# Altium schematic sheet Ethernet.SchDoc
size B
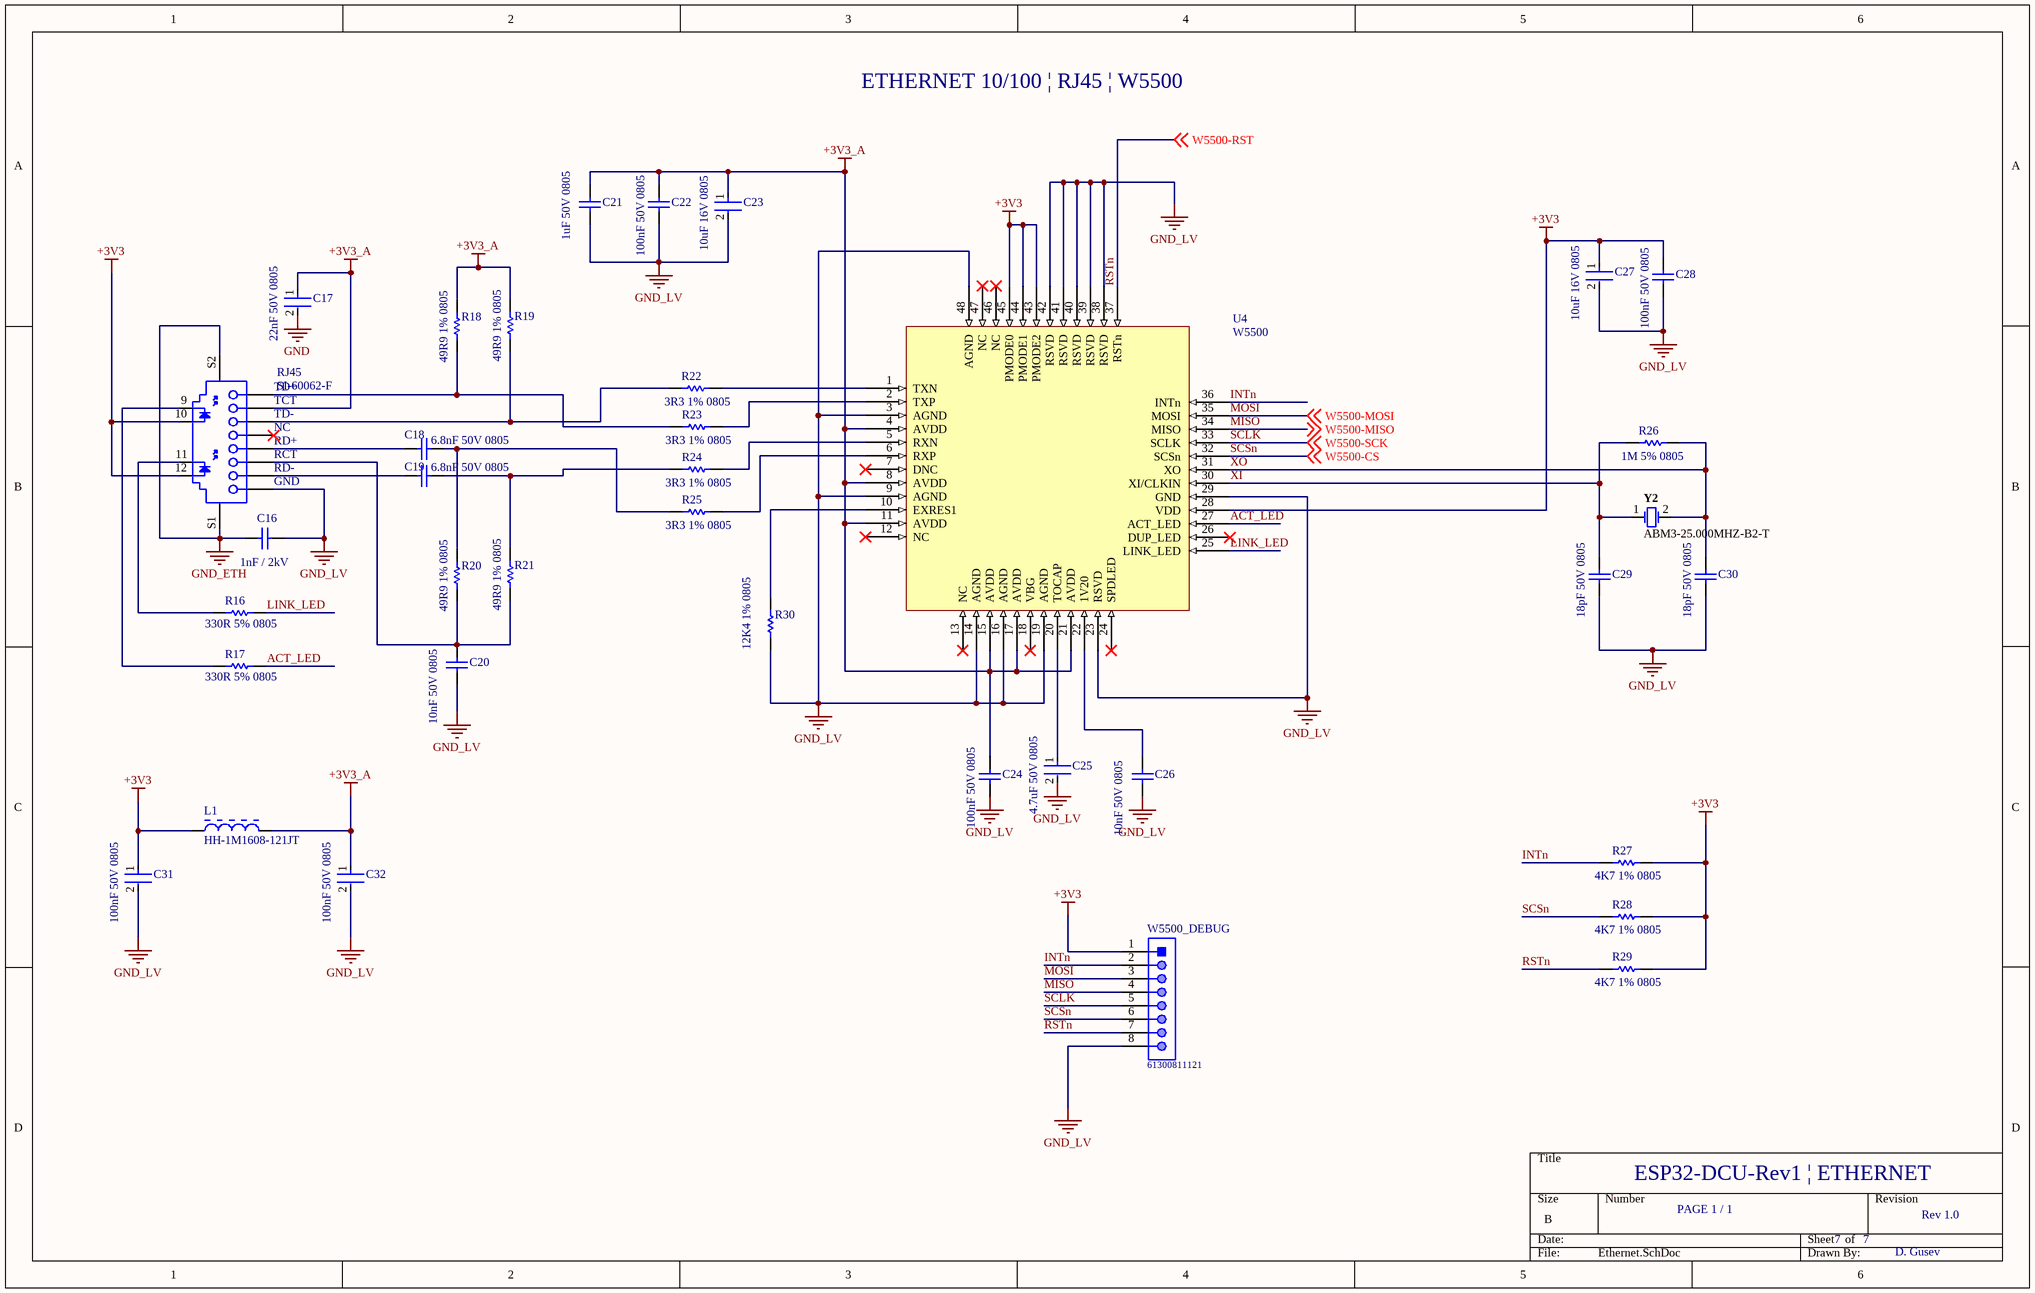
[diagram p0: Ethernet.SchDoc]

## Parts
C16  1nF / 2kV  [CAPC4532X155X60LL30T35]
C17  22nF 50V 0805  [FP-CL21-IPC_A]
C18  6.8nF 50V 0805  [CAPC2013X94X50NL20T25]
C19  6.8nF 50V 0805  [CAPC2013X94X50NL20T25]
C20  10nF 50V 0805  [CAPC2013X140X50NL20T25]
C21  1uF 50V 0805  [CAPC2013X135X45LL10T25]
C22  100nF 50V 0805  [CAPC2013X94X50ML20T25]
C23  10uF 16V 0805  [FP-GRM21B-0_1-IPC_C]
C24  100nF 50V 0805  [CAPC2013X94X50ML20T25]
C25  4.7uF 50V 0805  [FP-C2012-125-MFG]
C26  10nF 50V 0805  [CAPC2013X140X50NL20T25]
C27  10uF 16V 0805  [FP-GRM21B-0_1-IPC_C]
C28  100nF 50V 0805  [CAPC2013X94X50ML20T25]
C29  18pF 50V 0805  [CAPC2013X71X50LL20T25]
C30  18pF 50V 0805  [CAPC2013X71X50LL20T25]
C31  100nF 50V 0805  [FP-C0805C-DN-MFG]
C32  100nF 50V 0805  [FP-C0805C-DN-MFG]
L1  HH-1M1608-121JT  [CTC-1608_L]
R16  330R 5% 0805  [RESC2013X60X35LL10T20]
R17  330R 5% 0805  [RESC2013X60X35LL10T20]
R18  49R9 1% 0805  [RESC2013X60X40LL20T25]
R19  49R9 1% 0805  [RESC2013X60X40LL20T25]
R20  49R9 1% 0805  [RESC2013X60X40LL20T25]
R21  49R9 1% 0805  [RESC2013X60X40LL20T25]
R22  3R3 1% 0805  [RESC2013X70X40ML20T20]
R23  3R3 1% 0805  [RESC2013X70X40ML20T20]
R24  3R3 1% 0805  [RESC2013X70X40ML20T20]
R25  3R3 1% 0805  [RESC2013X70X40ML20T20]
R26  1M 5% 0805  [RESC2013X70X40NL20T20]
R27  4K7 1% 0805  [YAGO-RC0805_M]
R28  4K7 1% 0805  [YAGO-RC0805_M]
R29  4K7 1% 0805  [YAGO-RC0805_M]
R30  12K4 1% 0805  [RESC2013X60X35NL10T20]
RJ45  SI-60062-F  [BELF-SI-60062-F_V]
U4  W5500  [W5500]
W5500_DEBUG  61300811121  [61300811121]
Y2  ABM3-25.000MHZ-B2-T  [ABRA-ABM3_V]

## Nets
+3V3: C27.1 C28.2 C31.1 L1.1 R27.2 R28.2 R29.2 RJ45.10 RJ45.12 U4.28(VDD) U4.43(PMODE2) U4.44(PMODE1) U4.45(PMODE0) W5500_DEBUG.1
+3V3_A: C17.1 C21.2 C22.2 C23.1 C24.2 C32.1 L1.2 R18.2 R19.2 RJ45.2(TCT) U4.4(AVDD) U4.8(AVDD) U4.11(AVDD) U4.15(AVDD) U4.17(AVDD) U4.21(AVDD)
GND: C17.2
GND_ETH: C16.1 RJ45.S1 RJ45.S2
GND_LV: C16.2 C20.1 C21.1 C22.1 C23.2 C24.1 C25.2 C26.1 C27.2 C28.1 C29.1 C30.1 C31.2 C32.2 R30.1 RJ45.8(GND) U4.3(AGND) U4.9(AGND) U4.14(AGND) U4.16(AGND) U4.19(AGND) U4.23(RSVD) U4.29(GND) U4.38(RSVD) U4.39(RSVD) U4.40(RSVD) U4.41(RSVD) U4.42(RSVD) U4.48(AGND) W5500_DEBUG.8
ACT_LED: R17.2 U4.27(ACT_LED)
INTn: R27.1 U4.36(INTn) W5500_DEBUG.2
LINK_LED: R16.2 U4.25(LINK_LED)
MISO: U4.34(MISO) W5500_DEBUG.4 ; off-sheet W5500-MISO  [also labelled W5500-MISO]
MOSI: U4.35(MOSI) W5500_DEBUG.3 ; off-sheet W5500-MOSI  [also labelled W5500-MOSI]
RSTn: R29.1 U4.37(RSTn) W5500_DEBUG.7 ; off-sheet W5500-RST  [also labelled W5500-RST]
SCLK: U4.33(SCLK) W5500_DEBUG.5 ; off-sheet W5500-SCK  [also labelled W5500-SCK]
SCSn: R28.1 U4.32(SCSn) W5500_DEBUG.6 ; off-sheet W5500-CS  [also labelled W5500-CS]
XI: C29.2 R26.1 U4.30(XI/CLKIN) Y2.1
XO: C30.2 R26.2 U4.31(XO) Y2.2
NetC18_1: C18.1 RJ45.5(RD+)
NetC18_2: C18.2 R20.2 R25.1
NetC19_1: C19.1 RJ45.7(RD-)
NetC19_2: C19.2 R21.2 R24.1
NetC20_2: C20.2 R20.1 R21.1 RJ45.6(RCT)
NetC25_1: C25.1 U4.20(TOCAP)
NetC26_2: C26.2 U4.22(1V20)
NetR16_1: R16.1 RJ45.11
NetR17_1: R17.1 RJ45.9
NetR18_1: R18.1 R23.1 RJ45.1(TD+)
NetR19_1: R19.1 R22.1 RJ45.3(TD-)
NetR22_2: R22.2 U4.1(TXN)
NetR23_2: R23.2 U4.2(TXP)
NetR24_2: R24.2 U4.5(RXN)
NetR25_2: R25.2 U4.6(RXP)
NetR30_2: R30.2 U4.10(EXRES1)

Not connected (* = marked no-connect by the designer): RJ45 4(NC)*; U4 7(DNC)* 12(NC)* 13(NC)* 18(VBG)* 24(SPDLED)* 26(DUP_LED)* 46(NC)* 47(NC)*

## Notes on the sheet
- ETHERNET 10/100 | RJ45 | W5500
- ESP32-DCU-Rev1 | ETHERNET
- PAGE 1 / 1
- 7
- Rev 1.0
- D. Gusev

## Library data of the parts
C16 = CMP-2000-06032-1: Chip Capacitor, 1000 pF, +/- 10%, 2000 V, -55 to 125 degC, 1812 (4532 Metric), RoHS, Tape and Reel; Manufacturer: Kemet; Kits: 399-5086-ND-KITCERHI-VOLTAGECAPS; Catalog Drawings: ACTU_1812; Capacitance: 1000pF; Product Training Modules: CapacitorBasics-TypicalUsesforCapacitors; Online Catalog: X7RDielectricHighVoltage; Other Names: 399-3447-1; Temperature Coefficient: X7R; Voltage - Rated: 2000V(2kV); Family: CeramicCapacitors; Height - Seated (Max): -; Standard Package: 1; Size / Dimension: 0.177"Lx0.126"W(4.50mmx3.20mm); Datasheet URL: http://capacitoredge.kemet.com/capedge2/DataSheet/Datasheet-C1812C102KGRACTU.pdf?pn=C1812C102KGRACTU; Datasheet Version: 09/2016; Thickness (Max): 0.061"(1.55mm); Applications: SMPSFiltering; Package Description: 2-Pin Surface Mount Device, Body 4.5 x 3.2 mm; Package Reference: 1812; Mounting Technology: SurfaceMount; Packaging: CutTape(CT); Manufacturer URL: http://www.kemet.com/; Operating Temperature: -55°C~125°C; Mounting Type: SurfaceMount,MLCC; Features: HighVoltage; Package / Case: 1812(4532Metric); Lead Spacing: -; Tolerance: ±10%; Lead Style: -; Series: C; Category: Capacitors; Ratings: -
C17 = CMP-13271-002911-1: CL21 Series 0805 22nF 50V ±10% Tolerance X7R Multilayer Ceramic Chip Capacitor; Depth: 1.25mm; Thickness: 0.03inch; Height: 0.65mm; Material: Ceramic; Case/Package: 0805; Voltage Rating (DC): 50V; Contact Plating: Tin; Package Quantity: 1; Case Code (Metric): 2012; Max Operating Temperature: 125°C; Packaging: Tape and Reel; Voltage Rating: 50V; Radiation Hardening: No; Length: 2mm; Mount: Surface Mount; Min Operating Temperature: -55°C; Tolerance: 10%; Case Code (Imperial): 0805; Voltage: 50V; Capacitance: 22nF; Dielectric: X7R; Lead Free: Lead Free; Width: 0.049inch
C18 C19 = CMP-1036-03710-2: Manufacturer: AVX Interconnect / Elco; Part Number: 08055C682KAT2A
C20 C26 = CMP-2007-04596-1: Manufacturer: AVX Interconnect / Elco; Part Number: 08052C103KAT2A
C21 = CMP-1036-04761-2: Manufacturer: Murata; Part Number: GRM21BR71H105KA12L
C22 C24 C28 = CMP-2000-05016-1: Chip Capacitor, Ceramic, 0.1 uF, 10%, 50 V, 0805, RoHS, Tape and Reel; Manufacturer: AVX; Dielectric: X7R; Case Size/Dimension: 0805; Tolerance (%): ±10%; Rated Voltage: 50V; Capacitance: 100nF; Datasheet URL: http://www.farnell.com/datasheets/319609.pdf; Datasheet Version: Sep-07; Manufacturer URL: http://www.avx.com/
C23 C27 = CMP-2007-03453-2: Chip Multilayer Ceramic Capacitors for General Purpose, 0805, 10uF, X5R, 15%, 10%, 16V; Radiation Hardening: No; Thickness: 0.053inch; Voltage Rating (DC): 16V; Lead Free: Lead Free; Package Quantity: 1; Width: 1.25mm; Case Code (Imperial): 0805; Depth: 1.25mm; Packaging: Tape and Reel; Dielectric: X5R; Max Operating Temperature: 85°C; Tolerance: 10%; Voltage Rating: 16V; Voltage: 16V; Capacitance: 10uF; Height: 1.25mm; Case Code (Metric): 2012; Material: Ceramic; Mount: Surface Mount; Case/Package: 0805; REACH SVHC: No SVHC; Length: 2mm; Min Operating Temperature: -55°C; Termination: SMD/SMT
C25 = CMP-08246-000007-1: CAP CER 4.7UF 50V X5R 0805; Manufacturer Part Number: C2012X5R1H475K125AB; Manufacturer: TDK Corporation; Tolerance: 10%; Temperature Coefficient: 15%; Material: Ceramic; Mouser Description: Multilayer Ceramic Capacitors MLCC - SMD/SMT 0805 4.7uF 50volts X5R 10%; Category: Cap; Temperature Range High: +85°C; Digikey Description: CAP CER 4.7UF 50V X5R 0805; Voltage Rating: 50V; Device Class L1: Passive Components; Temperature Range Low: -55°C; Lead Free: Yes; ComponentLink2Description: Datasheet; Capacitance: 4.7uF; Octopart: https://octopart.com/c2012x5r1h475k125ab-tdk-25947720; Device Class L2: Capacitors; Value: 4.7uF; Temperature: -55°C to +85°C; ComponentLink2URL: https://product.tdk.com/info/en/catalog/datasheets/mlcc_commercial_general_en.pdf; RoHS: TRUE; Height: 1.45mm; Temperature Characteristic: X5R; Package: C2012-125; Device Class L3: Ceramic Capacitors; Automotive: No
C29 C30 = CMP-2007-04502-1: Manufacturer: AVX Interconnect / Elco; Part Number: 08055A180JAT2A
C31 C32 = CMP-2007-00279-2: CAP CER 0.1UF 50V X7R 0805; Manufacturer Part Number: C0805C104K5RACTU; Manufacturer: KEMET; Value: 0.10 μF; Tolerance: 0.1; Temperature Coefficient: 30ppm/°C; Material: Ceramic; Device Class L2: Capacitors; Temperature Range Low: -55°C; Voltage Rating: 50 V; Digikey Description: CAP CER 0.1UF 50V X7R 0805; Category: Cap; ComponentLink2Description: Datasheet; Octopart: https://octopart.com/c0805c104k5ractu-kemet-143926; RoHS: TRUE; ComponentLink2URL: https://content.kemet.com/datasheets/KEM_C1003_C0G_SMD.pdf; Temperature Characteristic: X7R; Temperature: -55°C to +125°C; Height: 0.88mm; Temperature Range High: +125°C; Device Class L1: Passive Components; Automotive: No; Lead Free: Yes; Ipc Land Pattern Name: CAPC200125X78; Device Class L3: Ceramic Capacitors; Mouser Description: Cap Ceramic 0.1uF 50V X7R 10% SMD 2.0 x 1.2 mm 125 C Paper T/R; Capacitance: 0.10 μF; Package: C0805C-DN
L1 = CMP-2000-06403-1: Chip Ferrite Bead, 0.14 Ohm, 1.1 A, -55 to 125 degC, 2-Pin SMD, RoHS, Tape and Reel; Manufacturer: CTC Coils; DC Resistance Max: 140MOhm; DC Current Max: 1.1A; Datasheet Version: 07/2004; Datasheet URL: http://data.icbank.com/ICBShop/board/beadhbm.pdf; PartNumber: HH-1M1608; Package Reference: 1608; Temperature Min: -55degC; Manufacturer URL: http://www.brokerforum.com/components-parts/CTCCoils-e-en.jsa; Mounting Technology: SurfaceMount; Temperature Max: 125degC; Package Description: 2-Pin Surface Mount Device, Body 1.6 x 0.8 mm; Packing: TapeandReel
R16 R17 = CMP-2000-06960-1: Chip Resistor, 330 Ohm, +/- 1%, 125 mW, -55 to 155 degC, 0805 (2012 Metric), RoHS, Tape and Reel; Manufacturer: Yageo; Voltage Rating: 150V; Temperature Coefficient: 100PPM/C; Power Rating: 125mW(1/8W); Resistance: 330Ohms; Datasheet Version: Rev. 7, 05/2017; Termination Style: SMD/SMT; Case Code - mm: 2012; Package Description: 2-Pin Surface Mounted Device, Body 2 x 1.25 mm; Operating Temperature Range: -55Cto+155C; Case Code - in: 0805; Packaging: Reel; Tolerance: 1%; Package Reference: 0805; Mounting Technology: SurfaceMount; Product: ThickFilmResistorsGeneralPurpose; Series: RC; Manufacturer URL: http://www.yageo.com/; Datasheet URL: http://www.yageo.com/documents/recent/PYu-RC_Group_51_RoHS_L_7.pdf
R18-R21 = CMP-2001-00841-1: Manufacturer: Panasonic; Part Number: ERA6AEB49R9V
R22-R25 = CMP-2001-00462-1: Part Number: ERJ-6RQF3R3V; Manufacturer: Panasonic
R26 = CMP-2001-04378-5: Chip Resistor, 1000 KOhm, +/- 1%, 0.125 W, -55 to 155 degC, 0805 (2012 Metric), RoHS, Tape and Reel; Manufacturer: Panasonic; Voltage Rating: 150 V; ComponentLink2URL: http://industrial.panasonic.com/cdbs/www-data/pdf/RDA0000/AOA0000C86.pdf; PackageReference: 0805; Min Operating Temperature: -55 degC; RoHSCompliant: true; Package Quantity: 5000; ComponentLink1URL: http://www.panasonic.com/; Pins: 2; Height: 0.6 mm; Packaging: Tape and Reel; ComponentLink2Description: Datasheet; ComponentLink1Description: Manufacturer URL; Mounting Technology: Surface Mount; REACH SVHC: Yes; Mount: Surface Mount; PackageDescription: 2-Pin Surface Mount Device, Body 2 x 1.25 mm; DatasheetVersion: 04/2015; Max Operating Temperature: 155 degC; Length: 2 mm
R27-R29 = CMP-1568-00001-1: General Puprose Chip Resistor, 4700 Ohm +/- 1%, 0.125 W, -55 to 155 degC, 2-Pin SMD, RoHS, Tape and Reel; PartNumber: RC0805FR-074K7L; Tolerance: +/- 1%; Power: 0.125 W; PackageDescription: 2-Pin Surface Mount Device, Body 2 x 1.25 mm; ComponentLink2URL: http://www.yageo.com/documents/recent/PYu-RC_Group_51_RoHS_L-3.pdf; Temperature Min: -55 degC; Packing: Tape and Reel; Mounting Technology: Surface Mount; ComponentLink1URL: http://www.yageo.com/NewPortal/_en/index.jsp; Resistance: 4700 Ohm; Temperature Max: 155 degC; ComponentLink2Description: Datasheet; DatasheetVersion: Rev. 3; RoHS: TRUE; ComponentLink1Description: Manufacturer URL
R30 = CMP-2001-00911-1: Part Number: RC0805FR-0712K4L; Manufacturer: Yageo
RJ45 = CMP-2000-07059-1: 1 Port RJ45 Magjack Connector with Yellow and Green LED, 10/100 Base-T, 12-Pin THD, RoHS, Tray; Manufacturer: Bel Fuse; Number of Ways: 8P4C; Gender: Female; Shield Type: STP; Connector Type: RJ45; Contact Plating: Gold; Mounting Type: ThroughHole; Datasheet Version: Rev. B0, 09/2008; Package Reference: SI-60062-F; Manufacturer URL: http://belfuse.com/; Package Description: 12-Pin Through Hole Device, Body 21.59 x 16.13 mm; Series: MagJack; Contact Material: CopperAlloy; Datasheet URL: http://belfuse.com/pdfs/SI-60062-F.pdf; Width: 17.98mm; Length: 15.21mm; Mounting Technology: ThroughHole; Depth: 21.59mm; Orientation: Straight
U4 = W5500: W5500 10/100 ETHERNET
W5500_DEBUG = CMP-1502-01076-1: THT Vertical Pin Header WR-PHD, Pitch 2.54 mm, Single Row, 8 pins; Manufacturer: Wurth Elektronik; Rated Current: 3A; Pin Number: 8; Working Voltage: 250VAC; Gender: Male; Contact Resistance: 20mOhm; Pitch: 2.54mm; Withstanding Voltage: 500VAC; Publisher: WurthElektronik; Operating Temperature: -40to105degC; Orientation: Vertical; Row Number: Single; Part Number: 61300811121; Package Reference: 61300811121; Mounting Technology: THT; Packaging: Bag; Manufacturer URL: http://www.we-online.de; Datasheet URL: https://katalog.we-online.de/em/datasheet/6130xx11121.pdf
Y2 = CMP-2000-05729-1: Miniature Ceramic Crystal, 25 MHz, +/- 20 ppm, -20 to 70 degC, 2-Pin SMD, RoHS, Tape and Reel; Manufacturer: ABRACON; Case Height: 1.3mm; Tolerance: 20PPM; Load Capacitance: 18pF; Frequency: 25MHz; ESR: 30Ohms; Frequency Stability: 50PPM; Case Width: 3.2mm; Case Length: 5mm; Packaging: Reel; Package Description: 2-Pin Surface Mount Device, Body 5 x 3.2 mm; Manufacturer URL: http://www.abracon.com/; Mounting Technology: SurfaceMount; RoHS: Details; Operating Temperature Range: -20Cto+70C; Datasheet URL: http://www.abracon.com/Resonators/abm3.pdf; Type: MiniatureCeramicCrystal; Series: ABM3; Product Category: Crystals; Factory Pack Quantity: 1000; Mounting Style: SMD/SMT; Brand: ABRACON; Datasheet Version: 09/2013; Dimensions: 3.2mmWx5mmLx1.3mmH; Termination Style: SMD/SMT; Package Reference: ABM3; Package / Case: 5mmx3.2mm